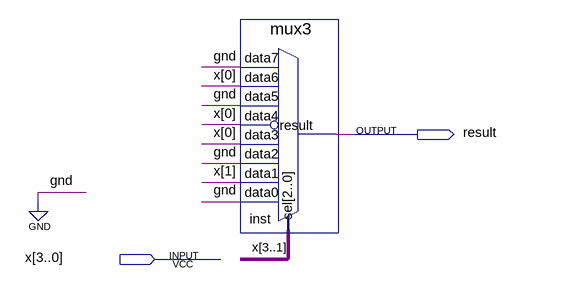
[diagram p0: schematic sheet]
// Quartus schematic b3.bdf as structural Verilog: 1 symbols, 2 pins
module b3 (
  input  [3:0] x,
  output result
);

  mux3 inst (
    .data0(1'b0), .data1(x[1]), .data2(1'b0), .data3(x[0]), .data4(~x[0]), .data5(1'b0), .data6(x[0]),
    .data7(1'b0), .sel(x[3:1]), .result(result));
endmodule
